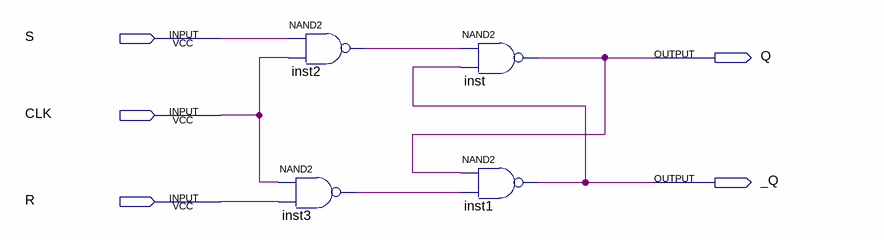
[diagram p0: schematic sheet]
// Quartus schematic ffrsclk.bdf as structural Verilog: 4 symbols, 5 pins
module ffrsclk (
  input  S,
  input  CLK,
  input  R,
  output Q,
  output _Q
);

  wire inst2_out, inst3_out;

  nand inst2 (inst2_out, S, CLK);
  nand inst3 (inst3_out, CLK, R);
  nand inst (Q, inst2_out, _Q);
  nand inst1 (_Q, Q, inst3_out);
endmodule
